# Altium schematic sheet Buck_Converter.SchDoc
size A4; SheetNumber: 3; SheetTotal: 4
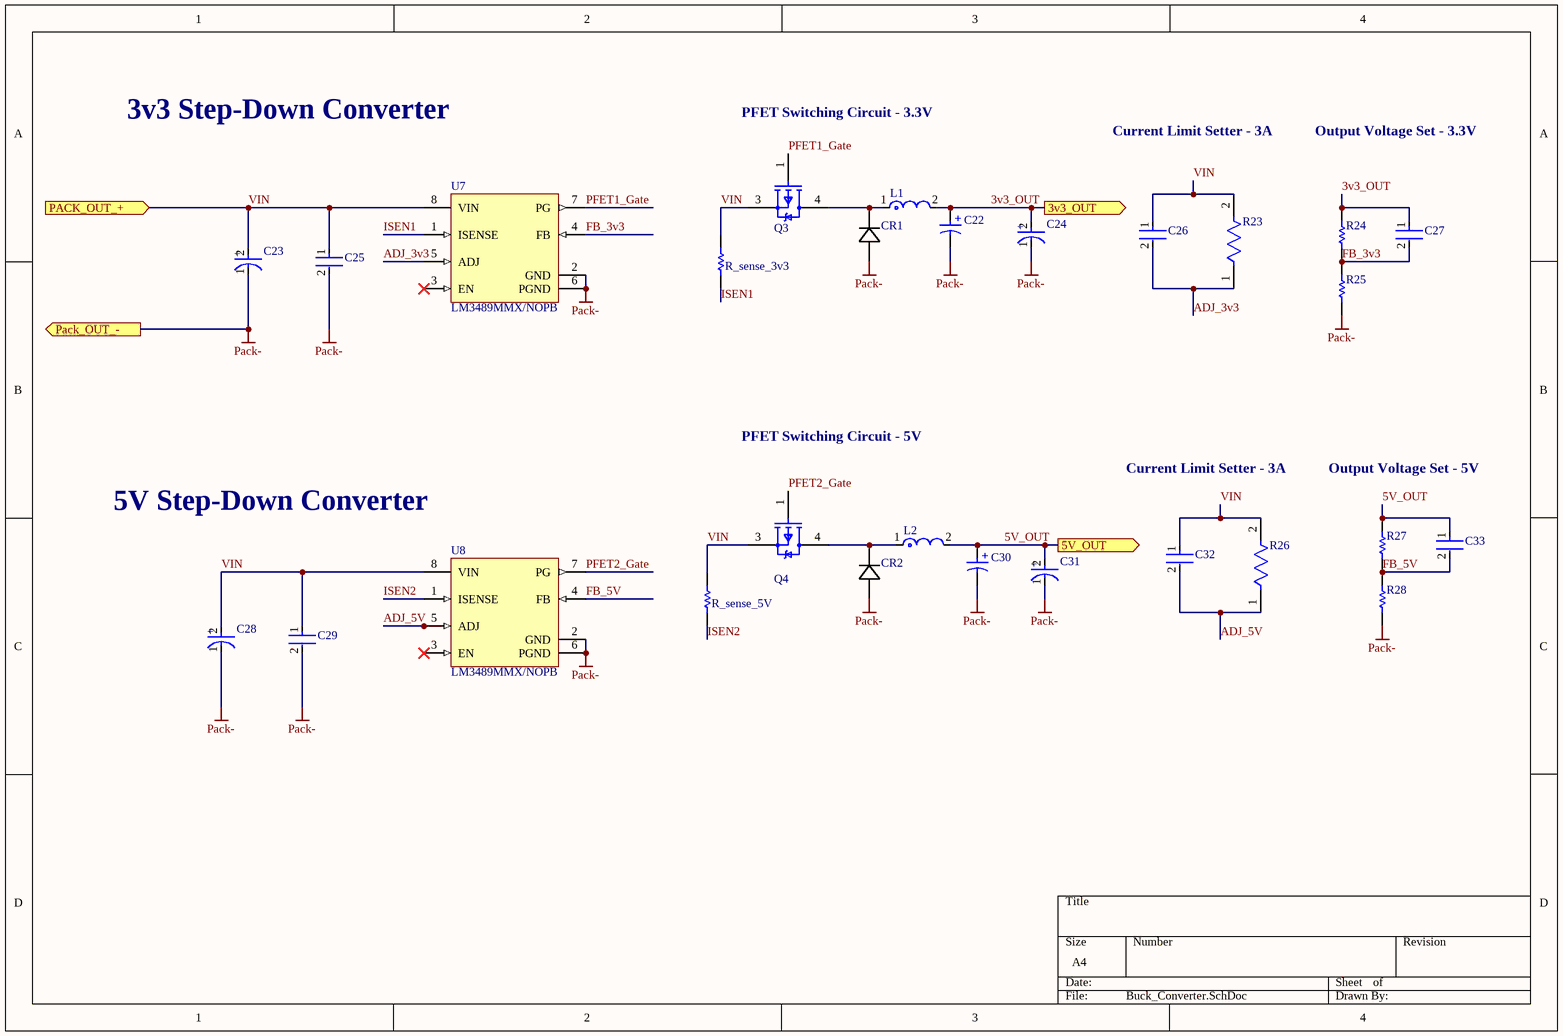
[diagram p0: Buck_Converter.SchDoc]

## Parts
C22  865080545012  [WCAP-ASLI_D6.3H7.7]  (value not drawn)
C23  EEEFK1H220P  [FP-FKD-MFG]  (value not drawn)
C24  EEE-FK1H100UR  [FP-FKC-MFG]  (value not drawn)
C25  C0603C104K5RACTU  [FP-C0603C-CF-MFG]  (value not drawn)
C26  C0603C104M5RACAUTO  [FP-C0603C-CF-MFG]  (value not drawn)
C27  C0603C101J5GACTU  [FP-C0603C-CF-MFG]  (value not drawn)
C28  EEEFK1H220P  [FP-FKD-MFG]  (value not drawn)
C29  C0603C104K5RACTU  [FP-C0603C-CF-MFG]  (value not drawn)
C30  865080545012  [WCAP-ASLI_D6.3H7.7]  (value not drawn)
C31  EEE-FK1H100UR  [FP-FKC-MFG]  (value not drawn)
C32  C0603C104M5RACAUTO  [FP-C0603C-CF-MFG]  (value not drawn)
C33  C0603C101J5GACTU  [FP-C0603C-CF-MFG]  (value not drawn)
CR1  B340AE-13  [CR_SMA_320-340AE_DIO]  (value not drawn)
CR2  B340AE-13  [CR_SMA_320-340AE_DIO]  (value not drawn)
L1  1217AS-H-150M=P3  [FP-DEM8045C-MFG]  (value not drawn)
L2  1217AS-H-150M=P3  [FP-DEM8045C-MFG]  (value not drawn)
Q3  IRFR9024NTRPBF  [FP-PG-TO252-3-MFG]  (value not drawn)
Q4  IRFR9024NTRPBF  [FP-PG-TO252-3-MFG]  (value not drawn)
R23  RMCF0603FT182K  [FP-RMCF0603-MFG]  (value not drawn)
R24  ERA3AEB333V  [RESC1608X55X30ML20T20]  (value not drawn)
R25  ERJ-3EKF2002V  [RESC1608X55X30ML15T15]  (value not drawn)
R26  RMCF0603FT182K  [FP-RMCF0603-MFG]  (value not drawn)
R27  ERA3AEB333V  [RESC1608X55X30ML20T20]  (value not drawn)
R28  CRCW060311K0FKEA  [RESC1609X50X30ML10T20]  (value not drawn)
R_sense_3v3  RL1220S-R15-F  [RESC2013X50X40LL20T20]  (value not drawn)
R_sense_5V  RL1220S-R15-F  [RESC2013X50X40LL20T20]  (value not drawn)
U7  LM3489MMX/NOPB  [DGK0008A_N]
U8  LM3489MMX/NOPB  [DGK0008A_N]

## Ports
3v3_OUT (out), 5V_OUT (out), PACK_OUT_+ (in), Pack_OUT_- (out)

## Nets
Pack-: C22.2(N) C23.1(C) C24.1(C) C25.2 C28.1(C) C29.2 C30.2(N) C31.1(C) CR1.2 CR2.2 R25.1 R28.1 U7.2(GND) U7.6(PGND) U8.2(GND) U8.6(PGND) ; port Pack_OUT_-
3v3_OUT: C22.1(P) C24.2(A) C27.1 L1.2 R24.2 ; port 3v3_OUT
5V_OUT: C30.1(P) C31.2(A) C33.1 L2.2 R27.2 ; port 5V_OUT
ADJ_3v3: C26.2 R23.1 U7.5(ADJ)
ADJ_5V: C32.2 R26.1 U8.5(ADJ)
FB_3v3: C27.2 R24.1 R25.2 U7.4(FB)
FB_5V: C33.2 R27.1 R28.2 U8.4(FB)
ISEN1: R_sense_3v3.2 U7.1(ISENSE)
ISEN2: R_sense_5V.2 U8.1(ISENSE)
PFET1_Gate: Q3.1(GATE) U7.7(PG)
PFET2_Gate: Q4.1(GATE) U8.7(PG)
VIN: C23.2(A) C25.1 C26.1 C28.2(A) C29.1 C32.1 Q3.3(SOURCE) Q4.3(SOURCE) R23.2 R26.2 R_sense_3v3.1 R_sense_5V.1 U7.8(VIN) U8.8(VIN) ; port PACK_OUT_+
NetCR1_1: CR1.1 L1.1 Q3.4(DRAIN)
NetCR2_1: CR2.1 L2.1 Q4.4(DRAIN)

Not connected (* = marked no-connect by the designer): U7 3(EN)*; U8 3(EN)*

## Notes on the sheet
- 3v3 Step-Down Converter
- PFET Switching Circuit - 3.3V
- Current Limit Setter - 3A
- Output Voltage Set - 3.3V
- PFET Switching Circuit - 5V
- 5V Step-Down Converter
- Output Voltage Set - 5V
- (in symbol CMP-2000-06209-2) +
- (in symbol CMP-03913-54202496-1) +
- (in symbol CMP-05427-000030-1) +

## Library data of the parts
C22 C30 = CMP-03913-54202496-1: 865080545012 Cap Aluminum Lytic 100uF 35V 20% (6.3 X 7.7mm) SMD 300mA 2000h 105C T/R; Leakage Current: 35µA; Impedance: 380mΩ; Life (Hours): 2000hours; Capacitance: 100µF; Dissipation Factor: 14%; Insulation Resistance: 1MΩ; ESR (Equivalent Series Resistance): 321.392mΩ; Case/Package: Radial; Packaging: Cut Tape; REACH SVHC: Unknown; Voltage Rating (DC): 35V; Diameter: 6.3mm; Min Operating Temperature: -55°C; Ripple Current: 300mA; Height: 7.7mm; Voltage Rating: 35V; RoHS: Compliant; Width: 6.6mm; Ripple Current (AC): 300mA; NexarPartId: 54202496; Max Operating Temperature: 105°C; Tolerance: 20%; Length: 7.7mm
C23 C28 = CMP-2000-06209-2: CAP ALUM 22UF 20% 50V SMD; Life (Hours): 2000Hour; Ripple Current: 165mA; ESR (Equivalent Series Resistance): 880mR; Dielectric Material: Aluminium; Leakage Current: 3uA; Polarity: Polar; Radiation Hardening: No; Lead Free: Lead Free; Capacitance: 22uF; Package Quantity: 1000; Width: 7.8mm; Length: 5.8mm; Max Operating Temperature: 105°C; Tolerance: 20%; Height - Seated (Max): 0.24inch; Height: 5.8mm; Voltage Rating: 50V; Diameter: 6.3mm; Series: FK; Voltage: 50V; Termination: SMD/SMT; Construction: Cylindrical; Mount: Surface Mount; Number of Pins: 2; Case/Package: Radial; Packaging: Tape and Reel; Ripple Current (AC): 165mA; REACH SVHC: No SVHC; Min Operating Temperature: -55°C; Contact Plating: Tin; Voltage Rating (DC): 50V; RoHS Compliant: Yes; Impedance: 880mR
C24 C31 = CMP-05427-000030-1: CAP ALUM 10UF 20% 50V SMD; Impedance: 1.52R; Ripple Current (AC): 85mA; Life (Hours): 2000Hour; Leakage Current: 3uA; Dielectric Material: Aluminium; Length: 5.8mm; Voltage Rating: 50V; Radiation Hardening: No; Max Operating Temperature: 105°C; REACH SVHC: No SVHC; Tolerance: 20%; RoHS Compliant: Yes; Case/Package: Radial; Height: 5.8mm; Voltage: 50V; Diameter: 5mm; Number of Pins: 2; Ripple Current: 85mA; Series: FK; Lead Free: Lead Free; Width: 6.5mm; ESR (Equivalent Series Resistance): 1.52R; Package Quantity: 1000; Construction: Cylindrical; Voltage Rating (DC): 50V; Packaging: Tape and Reel; Height - Seated (Max): 0.228inch; Contact Plating: Tin; Capacitance: 10uF; Min Operating Temperature: -55°C; Termination: SMD/SMT; Material: Aluminium; Mount: Surface Mount
C25 C29 = CMP-2006-03061-2: CAP CER 0.1UF 50V X7R 0603; Manufacturer: KEMET; Tolerance: 0.1; Temperature Coefficient: 30ppm/°C; Material: Ceramic; Automotive Grade: Grade 1; Value: 0.10 μF; Temperature: -55°C to +125°C; RoHS: TRUE; Temperature Range High: +125°C; Lead Free: Yes; Octopart: https://octopart.com/c0603c104k5ractu-kemet-139244; Digikey Description: CAP CER 0.1UF 50V X7R 0603; Category: Cap; Package: C0603C-CF; ComponentLink2Description: Datasheet; Temperature Range Low: -55°C; Device Class L1: Passive Components; Voltage Rating: 50 V; Automotive: Yes; Device Class L3: Ceramic Capacitors; ComponentLink2URL: https://api.kemet.com/component-edge/download/datasheet/C0603C100J5GACAUTO.pdf; Capacitance: 0.10 μF; Device Class L2: Capacitors; Manufacturer Part Number: C0603C104K5RACTU; Temperature Characteristic: X7R; Height: 0.87mm
C26 C32 = CMP-03020-028971-1: C0603 0.10 μF X7R 30ppm/°C 20.00% 50 V; Manufacturer: KEMET; Voltage Rating: 50 V; Value: 0.10 μF; Tolerance: 0.2; Automotive Grade: Grade 1; Material: Ceramic; Temperature Characteristic: X7R; Temperature Range Low: -55°C; Automotive: Yes; Manufacturer Part Number: C0603C104M5RACAUTO; Mouser Description: Cap Ceramic 0.1uF 50V X7R 20% SMD 0603 125°C Paper T/R; RoHS: TRUE; Device Class L3: Ceramic Capacitors; Temperature Range High: +125°C; ComponentLink2Description: Datasheet; ComponentLink2URL: https://api.kemet.com/component-edge/download/datasheet/C0603C100J5GACAUTO.pdf; Package: C0603C-CF; Device Class L1: Passive Components; Device Class L2: Capacitors; Height: 0.87mm; Temperature: -55°C to +125°C; Octopart: https://octopart.com/c0603c104m5racauto-kemet-75146604; Capacitance: 0.10 μF; Temperature Coefficient: 30ppm/°C; Category: Cap; Lead Free: Yes
C27 C33 = CMP-2006-03408-2: CAP CER 100PF 50V C0G/NP0 0603; Manufacturer: KEMET; Material: Ceramic; Tolerance: 0.05; Automotive Grade: Grade 1; Temperature Coefficient: 30ppm/°C; Temperature Characteristic: C0G; RoHS: TRUE; Temperature Range Low: -55°C; Automotive: Yes; Digikey Description: CAP CER 100PF 50V C0G/NP0 0603; Voltage Rating: 50 V; Lead Free: Yes; Category: Cap; Manufacturer Part Number: C0603C101J5GACTU; Device Class L3: Ceramic Capacitors; Mouser Description: Multilayer Ceramic Capacitor, C Series, 100 Pf, - 5%, C0g / Np0, 50 V, 0603 [1608 Metric] Rohs Compliant: Yes; Value: 100 pF; Device Class L1: Passive Components; Temperature: -55°C to +125°C; ComponentLink2URL: https://api.kemet.com/component-edge/download/datasheet/C0603C100J5GACAUTO.pdf; Temperature Range High: +125°C; ComponentLink2Description: Datasheet; Octopart: https://octopart.com/c0603c101j5gactu-kemet-100052; Device Class L2: Capacitors; Height: 0.87mm; Capacitance: 100 pF; Package: C0603C-CF
CR1 CR2 = B340AE-13: No Description Available; Mfr_Name: Diodes Inc
L1 L2 = CMP-06042-011831-1: Shielded Wirewound Inductor 15uH 20% 3500mA 0.0528Ω SMD; Core Material: Ferrite; DC Resistance (DCR): 52.8mR; Current Rating: 3.5A; Saturation Current: 3.3A; Test Frequency: 100kHz; Inductance: 15uH; Packaging: Tape and Reel; Width: 0.315inch; Shielding: Shielded; Number of Pins: 2; Tolerance: 20%; Mount: Surface Mount; Resistor Type: Wirewound; Case/Package: SMD/SMT; Max DC Current: 3.5A; Length: 0.315inch; Height - Seated (Max): 0.177inch
Q3 Q4 = CMP-32901-000043-2: MOSFET P-CH 55V 11A DPAK; Power Dissipation: 38W; Rds On Max: 175mR; Drain to Source Breakdown Voltage: -55V; Turn-On Delay Time: 13ns; Threshold Voltage: -4V; Turn-Off Delay Time: 23ns; Rise Time: 55ns; Gate to Source Voltage (Vgs): 20V; Input Capacitance: 350pF; Max Operating Temperature: 150°C; Mount: Surface Mount; Contact Plating: Tin; Max Power Dissipation: 38W; Width: 0.245inch; RoHS Compliant: Yes; Lead Free: Contains Lead; REACH SVHC: No SVHC; Drain to Source Resistance: 175mR; Packaging: Tape and Reel; Halogen Free: Halogen Free; Continuous Drain Current (ID): 11A; Max Dual Supply Voltage: -55V; Number of Pins: 3; Height: 0.094inch; Min Operating Temperature: -55°C; Case/Package: TO-252-3; Drain to Source Voltage (Vdss): -55V
R23 R26 = CMP-26527-007599-1: RES 182K OHM 1% 1/10W 0603; Resistance: 182kR; Power Rating: 100mW; Temperature Coefficient: 100ppm/°C; Lead Free: Lead Free; Series: RMCF; Min Operating Temperature: -55°C; Features: Automotive AEC-Q200; Length: 0.061inch; Resistor Type: Thick Film; Case Code (Metric): 1608; Packaging: Tape and Reel; Tolerance: 1%; Height: 0.022inch; Package Quantity: 1; Contact Plating: Tin; RoHS Compliant: Yes; Size Code: 0603; Max Power Dissipation: 100mW; Number of Terminations: 2; Width: 0.031inch; Max Operating Temperature: 155°C; Radiation Hardening: No; Case/Package: 0603; Case Code (Imperial): 0603; Ratings: AEC-Q200; Mount: Surface Mount
R24 R27 = CMP-2000-00041-1: Manufacturer: Panasonic; Part Number: ERA3AEB333V
R25 = CMP-2000-00318-1: Manufacturer: Panasonic; Part Number: ERJ-3EKF2002V
R28 = CMP-2000-03860-1: Manufacturer: Vishay Dale; Part Number: CRCW060311K0FKEA
R_sense_3v3 R_sense_5V = CMP-2001-03155-1: Manufacturer: Susumu; Part Number: RL1220S-R15-F
U7 U8 = CMP-0069-01740-3: Hysteretic PFET Buck Controller with Enable Pin, 8-pin MSOP, Pb-Free; Manufacturer: Texas Instruments; PowerWise: N; CompType: Switcher; PackageTopMarking: ZXTT*SKSB; PinCount: 8; ComponentLink1URL: http://www.ti.com/general/docs/lit/getliterature.tsp?genericPartNumber=LM3489&fileType=pdf; PackageDescription: MINI SOIC, .118 x .118 x .034in, 8 Lead, .0256in Pitch; Code_JEDEC: MO-187-AA; ComponentLink1Description: Datasheet URL; RoHS: Y; PackageReference: DGK0008A